# Altium schematic sheet display.SchDoc: FPGA-based Sudoku - display
size C; Author: Justin Silver; DocumentNumber: 3; Revision: v1.0; SheetNumber: 3; SheetTotal: 4
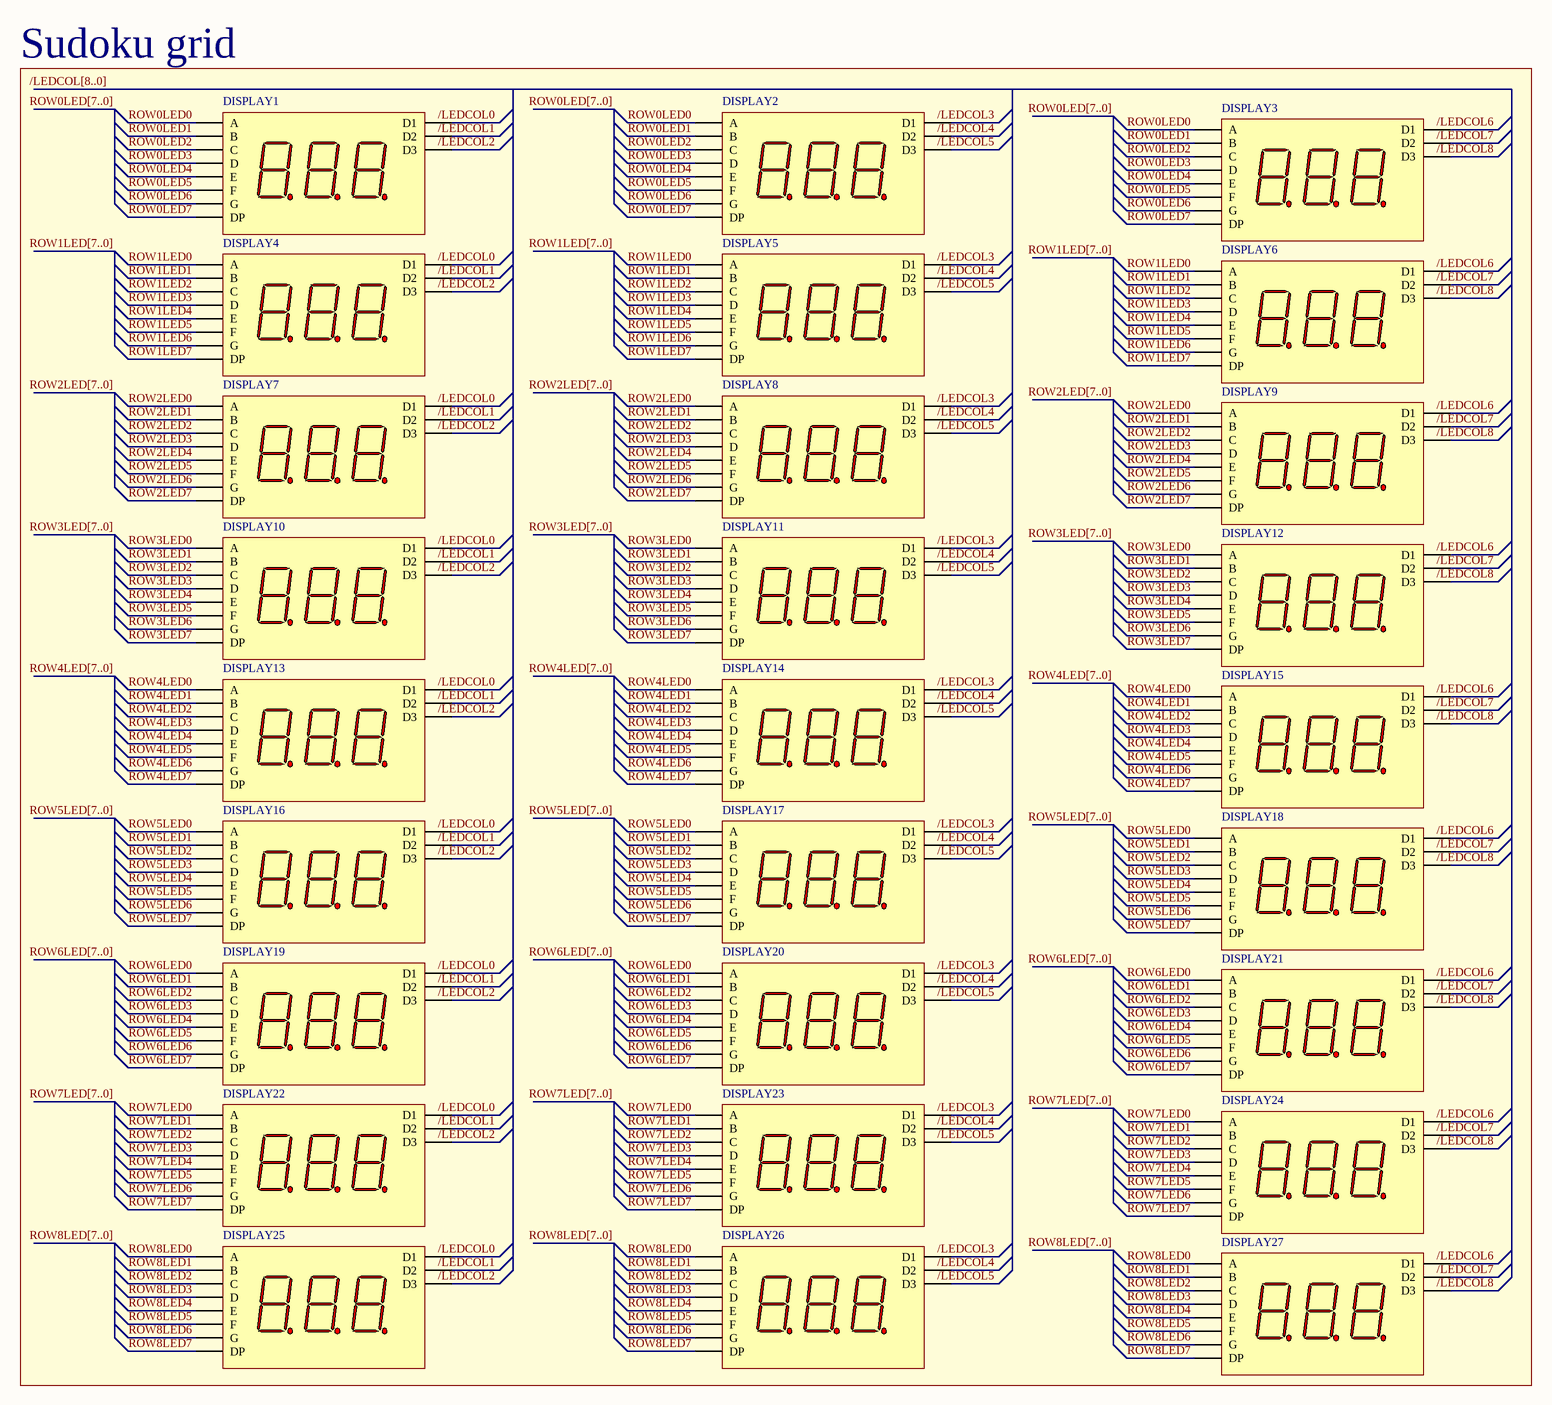
[diagram p0: display.SchDoc]

## Parts
DISPLAY1  (no value)  [3DIGITDISPLAY]
DISPLAY2  (no value)  [3DIGITDISPLAY]
DISPLAY3  (no value)  [3DIGITDISPLAY]
DISPLAY4  (no value)  [3DIGITDISPLAY]
DISPLAY5  (no value)  [3DIGITDISPLAY]
DISPLAY6  (no value)  [3DIGITDISPLAY]
DISPLAY7  (no value)  [3DIGITDISPLAY]
DISPLAY8  (no value)  [3DIGITDISPLAY]
DISPLAY9  (no value)  [3DIGITDISPLAY]
DISPLAY10  (no value)  [3DIGITDISPLAY]
DISPLAY11  (no value)  [3DIGITDISPLAY]
DISPLAY12  (no value)  [3DIGITDISPLAY]
DISPLAY13  (no value)  [3DIGITDISPLAY]
DISPLAY14  (no value)  [3DIGITDISPLAY]
DISPLAY15  (no value)  [3DIGITDISPLAY]
DISPLAY16  (no value)  [3DIGITDISPLAY]
DISPLAY17  (no value)  [3DIGITDISPLAY]
DISPLAY18  (no value)  [3DIGITDISPLAY]
DISPLAY19  (no value)  [3DIGITDISPLAY]
DISPLAY20  (no value)  [3DIGITDISPLAY]
DISPLAY21  (no value)  [3DIGITDISPLAY]
DISPLAY22  (no value)  [3DIGITDISPLAY]
DISPLAY23  (no value)  [3DIGITDISPLAY]
DISPLAY24  (no value)  [3DIGITDISPLAY]
DISPLAY25  (no value)  [3DIGITDISPLAY]
DISPLAY26  (no value)  [3DIGITDISPLAY]
DISPLAY27  (no value)  [3DIGITDISPLAY]

## Blocks framed on the sheet
Sudoku grid: DISPLAY1-DISPLAY27

## Nets
/LEDCOL0: DISPLAY1.12(D1) DISPLAY4.12(D1) DISPLAY7.12(D1) DISPLAY10.12(D1) DISPLAY13.12(D1) DISPLAY16.12(D1) DISPLAY19.12(D1) DISPLAY22.12(D1) DISPLAY25.12(D1)
/LEDCOL1: DISPLAY1.9(D2) DISPLAY4.9(D2) DISPLAY7.9(D2) DISPLAY10.9(D2) DISPLAY13.9(D2) DISPLAY16.9(D2) DISPLAY19.9(D2) DISPLAY22.9(D2) DISPLAY25.9(D2)
/LEDCOL2: DISPLAY1.8(D3) DISPLAY4.8(D3) DISPLAY7.8(D3) DISPLAY10.8(D3) DISPLAY13.8(D3) DISPLAY16.8(D3) DISPLAY19.8(D3) DISPLAY22.8(D3) DISPLAY25.8(D3)
/LEDCOL3: DISPLAY2.12(D1) DISPLAY5.12(D1) DISPLAY8.12(D1) DISPLAY11.12(D1) DISPLAY14.12(D1) DISPLAY17.12(D1) DISPLAY20.12(D1) DISPLAY23.12(D1) DISPLAY26.12(D1)
/LEDCOL4: DISPLAY2.9(D2) DISPLAY5.9(D2) DISPLAY8.9(D2) DISPLAY11.9(D2) DISPLAY14.9(D2) DISPLAY17.9(D2) DISPLAY20.9(D2) DISPLAY23.9(D2) DISPLAY26.9(D2)
/LEDCOL5: DISPLAY2.8(D3) DISPLAY5.8(D3) DISPLAY8.8(D3) DISPLAY11.8(D3) DISPLAY14.8(D3) DISPLAY17.8(D3) DISPLAY20.8(D3) DISPLAY23.8(D3) DISPLAY26.8(D3)
/LEDCOL6: DISPLAY3.12(D1) DISPLAY6.12(D1) DISPLAY9.12(D1) DISPLAY12.12(D1) DISPLAY15.12(D1) DISPLAY18.12(D1) DISPLAY21.12(D1) DISPLAY24.12(D1) DISPLAY27.12(D1)
/LEDCOL7: DISPLAY3.9(D2) DISPLAY6.9(D2) DISPLAY9.9(D2) DISPLAY12.9(D2) DISPLAY15.9(D2) DISPLAY18.9(D2) DISPLAY21.9(D2) DISPLAY24.9(D2) DISPLAY27.9(D2)
/LEDCOL8: DISPLAY3.8(D3) DISPLAY6.8(D3) DISPLAY9.8(D3) DISPLAY12.8(D3) DISPLAY15.8(D3) DISPLAY18.8(D3) DISPLAY21.8(D3) DISPLAY24.8(D3) DISPLAY27.8(D3)
ROW0LED0: DISPLAY1.11(A) DISPLAY2.11(A) DISPLAY3.11(A)
ROW0LED1: DISPLAY1.7(B) DISPLAY2.7(B) DISPLAY3.7(B)
ROW0LED2: DISPLAY1.4(C) DISPLAY2.4(C) DISPLAY3.4(C)
ROW0LED3: DISPLAY1.2(D) DISPLAY2.2(D) DISPLAY3.2(D)
ROW0LED4: DISPLAY1.1(E) DISPLAY2.1(E) DISPLAY3.1(E)
ROW0LED5: DISPLAY1.10(F) DISPLAY2.10(F) DISPLAY3.10(F)
ROW0LED6: DISPLAY1.5(G) DISPLAY2.5(G) DISPLAY3.5(G)
ROW0LED7: DISPLAY1.3(DP) DISPLAY2.3(DP) DISPLAY3.3(DP)
ROW1LED0: DISPLAY4.11(A) DISPLAY5.11(A) DISPLAY6.11(A)
ROW1LED1: DISPLAY4.7(B) DISPLAY5.7(B) DISPLAY6.7(B)
ROW1LED2: DISPLAY4.4(C) DISPLAY5.4(C) DISPLAY6.4(C)
ROW1LED3: DISPLAY4.2(D) DISPLAY5.2(D) DISPLAY6.2(D)
ROW1LED4: DISPLAY4.1(E) DISPLAY5.1(E) DISPLAY6.1(E)
ROW1LED5: DISPLAY4.10(F) DISPLAY5.10(F) DISPLAY6.10(F)
ROW1LED6: DISPLAY4.5(G) DISPLAY5.5(G) DISPLAY6.5(G)
ROW1LED7: DISPLAY4.3(DP) DISPLAY5.3(DP) DISPLAY6.3(DP)
ROW2LED0: DISPLAY7.11(A) DISPLAY8.11(A) DISPLAY9.11(A)
ROW2LED1: DISPLAY7.7(B) DISPLAY8.7(B) DISPLAY9.7(B)
ROW2LED2: DISPLAY7.4(C) DISPLAY8.4(C) DISPLAY9.4(C)
ROW2LED3: DISPLAY7.2(D) DISPLAY8.2(D) DISPLAY9.2(D)
ROW2LED4: DISPLAY7.1(E) DISPLAY8.1(E) DISPLAY9.1(E)
ROW2LED5: DISPLAY7.10(F) DISPLAY8.10(F) DISPLAY9.10(F)
ROW2LED6: DISPLAY7.5(G) DISPLAY8.5(G) DISPLAY9.5(G)
ROW2LED7: DISPLAY7.3(DP) DISPLAY8.3(DP) DISPLAY9.3(DP)
ROW3LED0: DISPLAY10.11(A) DISPLAY11.11(A) DISPLAY12.11(A)
ROW3LED1: DISPLAY10.7(B) DISPLAY11.7(B) DISPLAY12.7(B)
ROW3LED2: DISPLAY10.4(C) DISPLAY11.4(C) DISPLAY12.4(C)
ROW3LED3: DISPLAY10.2(D) DISPLAY11.2(D) DISPLAY12.2(D)
ROW3LED4: DISPLAY10.1(E) DISPLAY11.1(E) DISPLAY12.1(E)
ROW3LED5: DISPLAY10.10(F) DISPLAY11.10(F) DISPLAY12.10(F)
ROW3LED6: DISPLAY10.5(G) DISPLAY11.5(G) DISPLAY12.5(G)
ROW3LED7: DISPLAY10.3(DP) DISPLAY11.3(DP) DISPLAY12.3(DP)
ROW4LED0: DISPLAY13.11(A) DISPLAY14.11(A) DISPLAY15.11(A)
ROW4LED1: DISPLAY13.7(B) DISPLAY14.7(B) DISPLAY15.7(B)
ROW4LED2: DISPLAY13.4(C) DISPLAY14.4(C) DISPLAY15.4(C)
ROW4LED3: DISPLAY13.2(D) DISPLAY14.2(D) DISPLAY15.2(D)
ROW4LED4: DISPLAY13.1(E) DISPLAY14.1(E) DISPLAY15.1(E)
ROW4LED5: DISPLAY13.10(F) DISPLAY14.10(F) DISPLAY15.10(F)
ROW4LED6: DISPLAY13.5(G) DISPLAY14.5(G) DISPLAY15.5(G)
ROW4LED7: DISPLAY13.3(DP) DISPLAY14.3(DP) DISPLAY15.3(DP)
ROW5LED0: DISPLAY16.11(A) DISPLAY17.11(A) DISPLAY18.11(A)
ROW5LED1: DISPLAY16.7(B) DISPLAY17.7(B) DISPLAY18.7(B)
ROW5LED2: DISPLAY16.4(C) DISPLAY17.4(C) DISPLAY18.4(C)
ROW5LED3: DISPLAY16.2(D) DISPLAY17.2(D) DISPLAY18.2(D)
ROW5LED4: DISPLAY16.1(E) DISPLAY17.1(E) DISPLAY18.1(E)
ROW5LED5: DISPLAY16.10(F) DISPLAY17.10(F) DISPLAY18.10(F)
ROW5LED6: DISPLAY16.5(G) DISPLAY17.5(G) DISPLAY18.5(G)
ROW5LED7: DISPLAY16.3(DP) DISPLAY17.3(DP) DISPLAY18.3(DP)
ROW6LED0: DISPLAY19.11(A) DISPLAY20.11(A) DISPLAY21.11(A)
ROW6LED1: DISPLAY19.7(B) DISPLAY20.7(B) DISPLAY21.7(B)
ROW6LED2: DISPLAY19.4(C) DISPLAY20.4(C) DISPLAY21.4(C)
ROW6LED3: DISPLAY19.2(D) DISPLAY20.2(D) DISPLAY21.2(D)
ROW6LED4: DISPLAY19.1(E) DISPLAY20.1(E) DISPLAY21.1(E)
ROW6LED5: DISPLAY19.10(F) DISPLAY20.10(F) DISPLAY21.10(F)
ROW6LED6: DISPLAY19.5(G) DISPLAY20.5(G) DISPLAY21.5(G)
ROW6LED7: DISPLAY19.3(DP) DISPLAY20.3(DP) DISPLAY21.3(DP)
ROW7LED0: DISPLAY22.11(A) DISPLAY23.11(A) DISPLAY24.11(A)
ROW7LED1: DISPLAY22.7(B) DISPLAY23.7(B) DISPLAY24.7(B)
ROW7LED2: DISPLAY22.4(C) DISPLAY23.4(C) DISPLAY24.4(C)
ROW7LED3: DISPLAY22.2(D) DISPLAY23.2(D) DISPLAY24.2(D)
ROW7LED4: DISPLAY22.1(E) DISPLAY23.1(E) DISPLAY24.1(E)
ROW7LED5: DISPLAY22.10(F) DISPLAY23.10(F) DISPLAY24.10(F)
ROW7LED6: DISPLAY22.5(G) DISPLAY23.5(G) DISPLAY24.5(G)
ROW7LED7: DISPLAY22.3(DP) DISPLAY23.3(DP) DISPLAY24.3(DP)
ROW8LED0: DISPLAY25.11(A) DISPLAY26.11(A) DISPLAY27.11(A)
ROW8LED1: DISPLAY25.7(B) DISPLAY26.7(B) DISPLAY27.7(B)
ROW8LED2: DISPLAY25.4(C) DISPLAY26.4(C) DISPLAY27.4(C)
ROW8LED3: DISPLAY25.2(D) DISPLAY26.2(D) DISPLAY27.2(D)
ROW8LED4: DISPLAY25.1(E) DISPLAY26.1(E) DISPLAY27.1(E)
ROW8LED5: DISPLAY25.10(F) DISPLAY26.10(F) DISPLAY27.10(F)
ROW8LED6: DISPLAY25.5(G) DISPLAY26.5(G) DISPLAY27.5(G)
ROW8LED7: DISPLAY25.3(DP) DISPLAY26.3(DP) DISPLAY27.3(DP)

## Buses and harness runs
bus /LEDCOL[8..0]
bus ROW0LED[7..0]
bus ROW1LED[7..0]
bus ROW2LED[7..0]
bus ROW3LED[7..0]
bus ROW4LED[7..0]
bus ROW5LED[7..0]
bus ROW6LED[7..0]
bus ROW7LED[7..0]
bus ROW8LED[7..0]

## Library data of the parts
DISPLAY1 = 3DIGITREDCC: 7-Segment Display; MinimumIntensity: 360 ucd; Note: Pins 1 and 6 are redundant Cathodes.; Published: 8-Jun-2000; LatestRevisionDate: 17-Dec-2003; LatestRevisionNote: Schematic revised, PCB Footprint replaced.; DatasheetVersion: 19-Feb-2002; PackageVersion: 11-Feb-2002; PackageReference: A; Publisher: Altium Limited; PackageDescription: LED, 7-Segment Display, 7.62 mm, RHD; 10 Leads; Row Space 5.08 mm; Pitch 2.54 mm; Colour: High Efficiency Red (HER); ComponentLink1Description: Manufacturer Link; ComponentLink1URL: http://www.agilent.com/
DISPLAY2-DISPLAY27 = 3DIGITREDCC: 7.62 mm Black Surface HER 7-Segment Display: CC, RH DP; MinimumIntensity: 360 ucd; Note: Pins 1 and 6 are redundant Cathodes.; Published: 8-Jun-2000; LatestRevisionDate: 17-Dec-2003; LatestRevisionNote: Schematic revised, PCB Footprint replaced.; DatasheetVersion: 19-Feb-2002; PackageVersion: 11-Feb-2002; PackageReference: A; Publisher: Altium Limited; PackageDescription: LED, 7-Segment Display, 7.62 mm, RHD; 10 Leads; Row Space 5.08 mm; Pitch 2.54 mm; Colour: High Efficiency Red (HER); ComponentLink1Description: Manufacturer Link; ComponentLink1URL: http://www.agilent.com/